# EAGLE design eCog101_I2C_TFT_.96 (EAGLE 6.6.0)
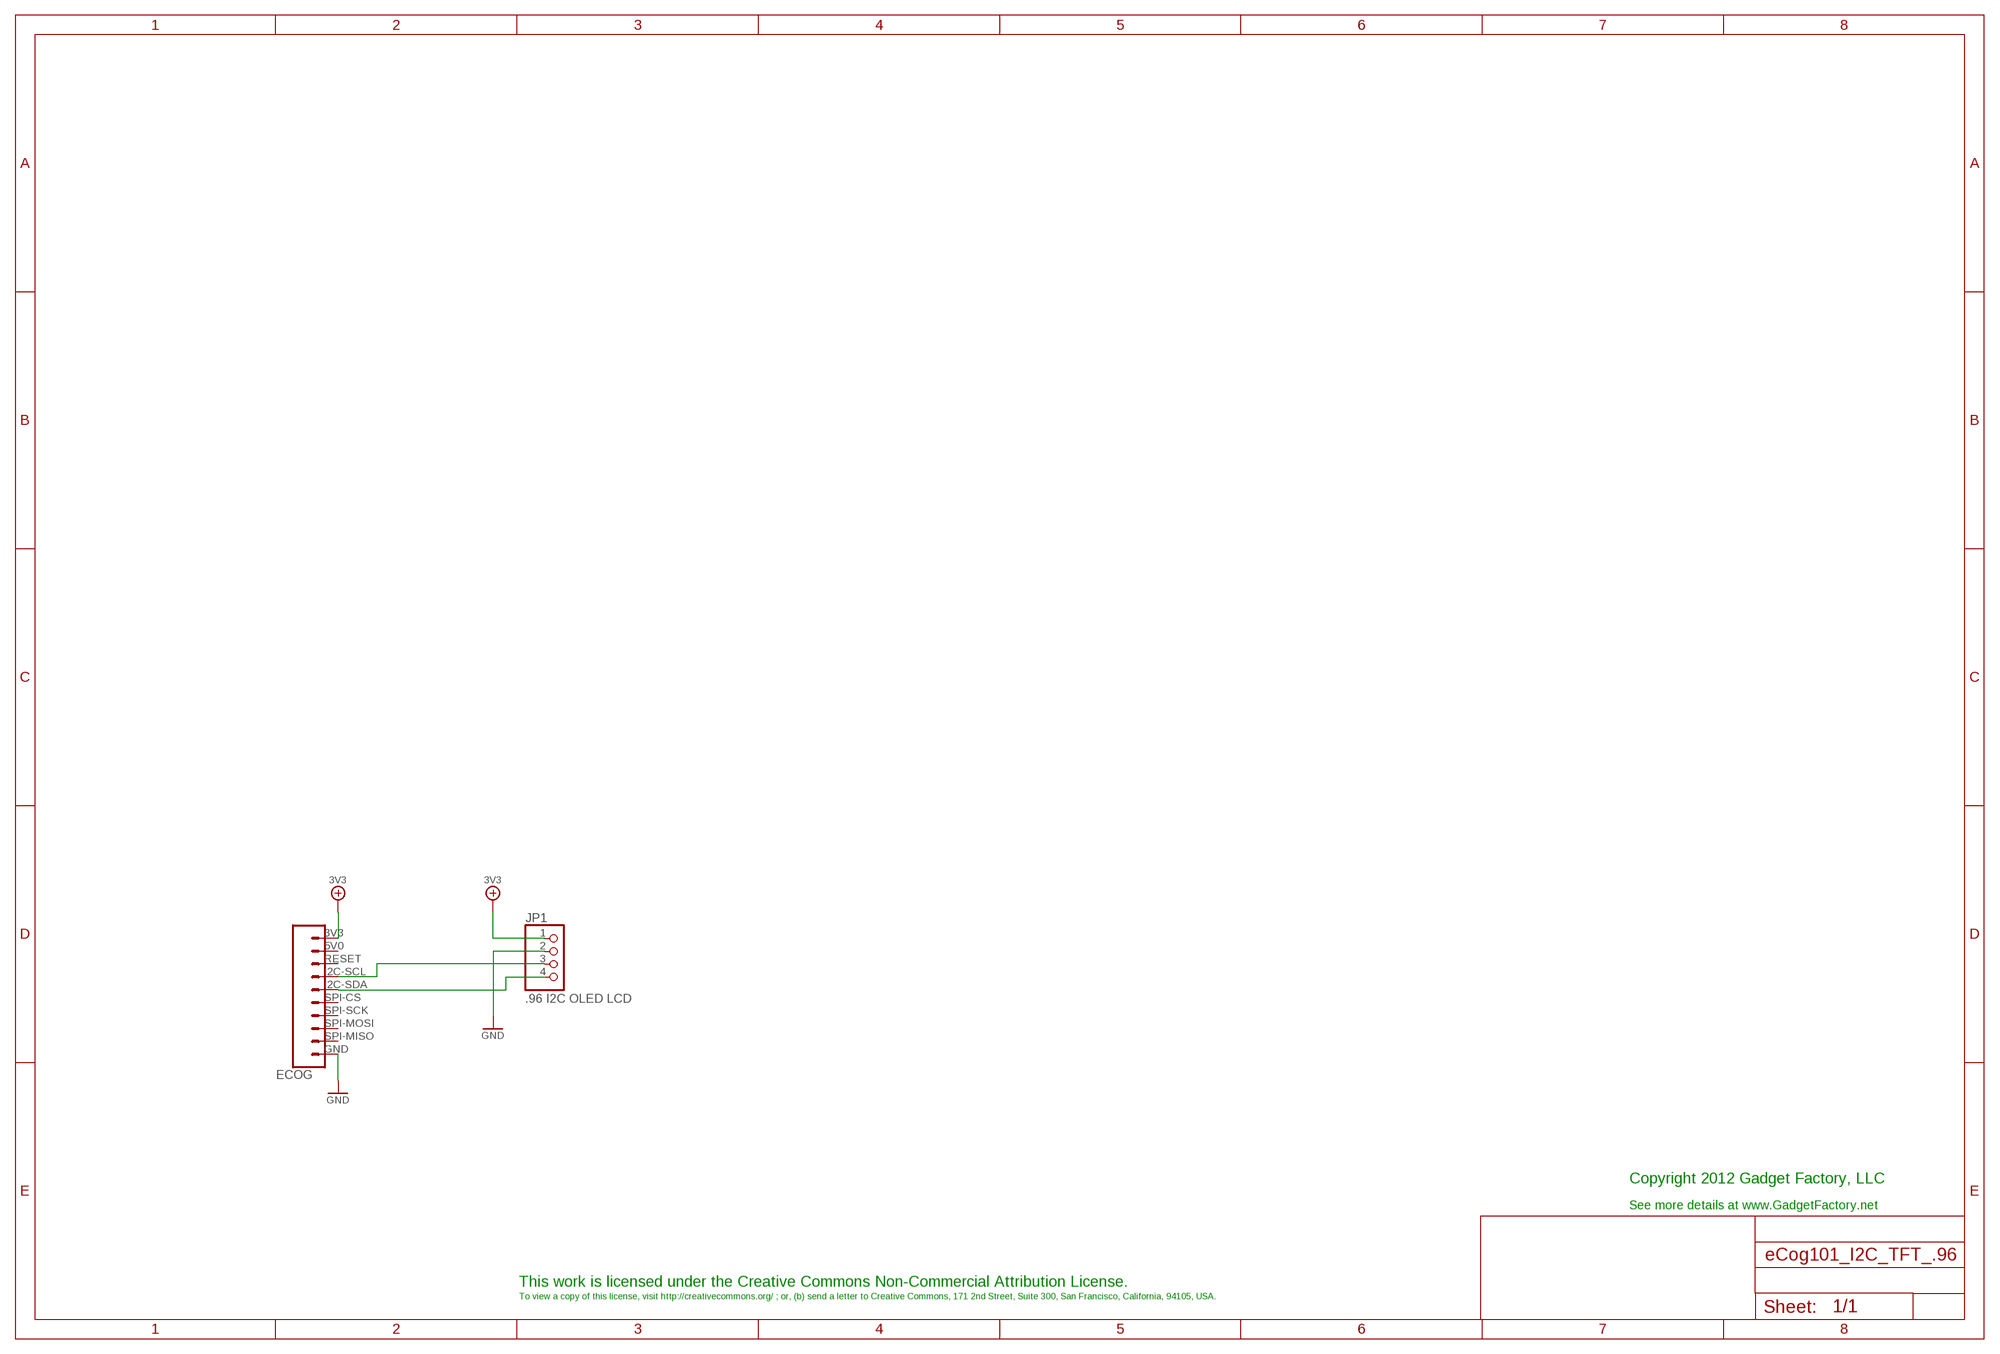
[diagram p0: schematic, sheet 1]

## Parts
ECOG  ECOG_BUSES_ROWECOG_BUSES_SMD  [ECOG_BUSES_SMD]
JP1  .96 I2C OLED LCD  PINHD-1X4  [1X04]

## Nets
3V3: ECOG.3V3 JP1.1
GND: ECOG.GND JP1.2
N$1: ECOG.I2C-SCL JP1.3
N$2: ECOG.I2C-SDA JP1.4
Unconnected: ECOG.5V0 ECOG.RESET ECOG.SPI-CS ECOG.SPI-MISO ECOG.SPI-MOSI ECOG.SPI-SCK

## Notes on the sheet
- Copyright 2012 Gadget Factory, LLC
- See more details at www.GadgetFactory.net
- This work is licensed under the Creative Commons Non-Commercial Attribution License.
- To view a copy of this license, visit http://creativecommons.org/ ; or, (b) send a letter to Creative Commons, 171 2nd Street, Suite 300, San Francisco, California, 94105, USA.

## Library data of the parts
ECOG = eCogs:ECOG_BUSES_ROW; DIGIKEY: S1013EC-10-ND
JP1 = pinhead:PINHD-1X4: PIN HEADER; DEALEXTREME: 419232

## Board
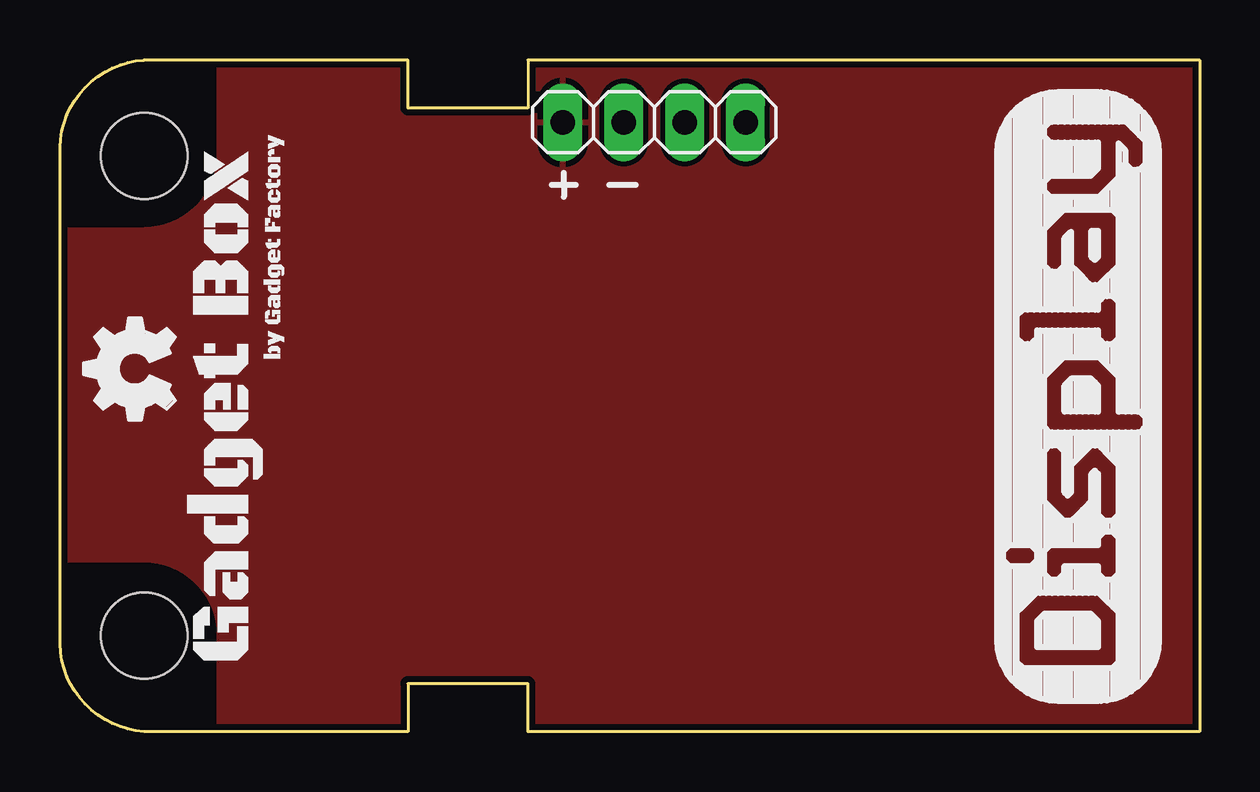
[diagram p1: board, top side]
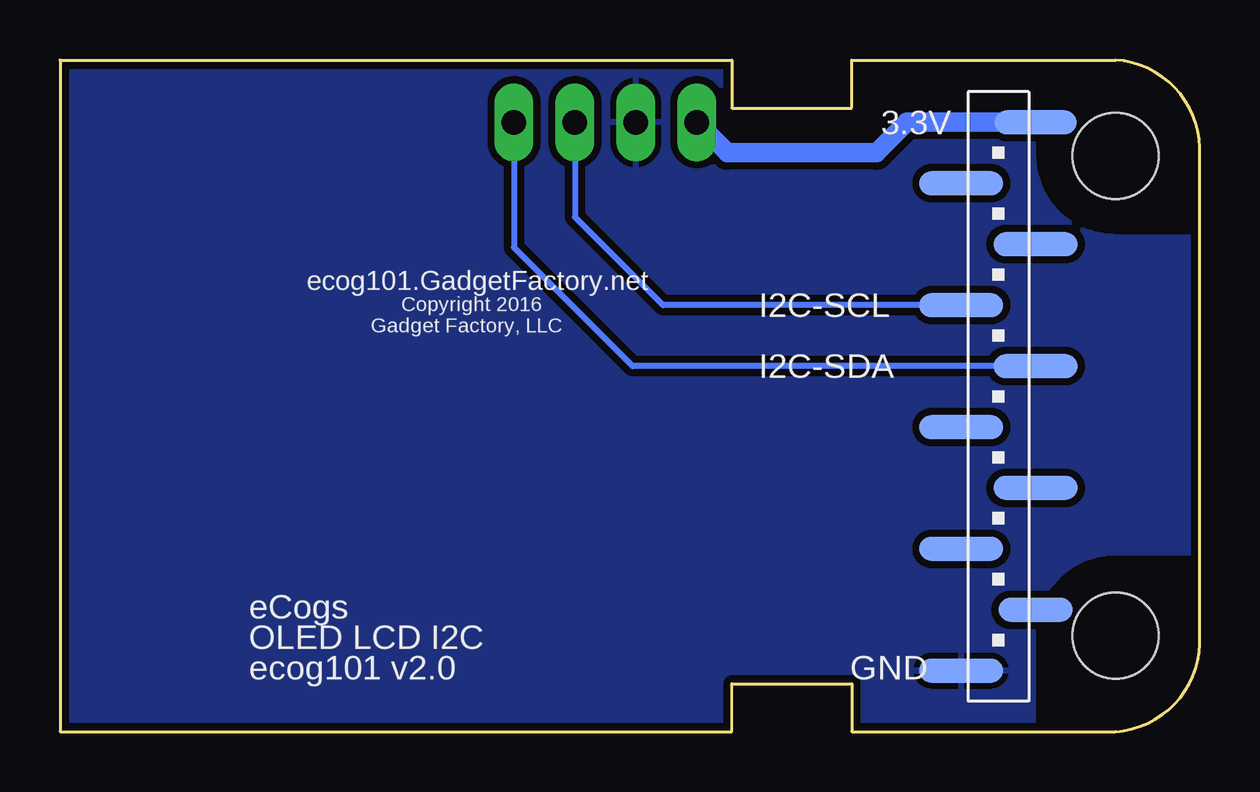
[diagram p2: board, bottom side, seen from below]

Size 47.51 x 28 mm. Coordinates in mm from the lower left corner, seen from the top.
Copper layers (1*16): Top 0.035mm / dielectric 1.5mm / Bottom 0.035mm
Design rules "SparkFun": minimum track width 8mil, minimum drill 20mil, track to track 8mil, track to pad 8mil, pad to pad 8mil, via to via 8mil, smd to smd 8mil, copper to edge 10mil, drill to drill 8mil, minimum pad ring 12mil, minimum via ring 10mil, stop-mask expansion 4mil, vias tented up to drill 25mil, thermal gap 10mil

### Footprints (pad centres in the part's own frame; a part is rotated, then mirrored left to right if it is on the bottom)
ECOG_BUSES_SMD = smd 3.4 x 1 bottom: 3V3 7.337,25.4 | smd 3.5 x 1 bottom: 5V0 10.436,22.86; GND 10.436,2.54; I2C-SCL 10.436,17.78; I2C-SDA 7.337,15.24; RESET 7.337,20.32; SPI-CS 10.436,12.7; SPI-MOSI 10.436,7.62; SPI-SCK 7.337,10.16 | smd 3.1 x 1 bottom: SPI-MISO 7.337,5.08 | hole 3.6: 4.004,24.003; 4.004,4.003
1X04 = drill 1.016 long: 1 -3.81,0; 2 -1.27,0; 3 1.27,0; 4 3.81,0

### Placement (x,y rotation side)
ECOG  ECOG_BUSES_ROWSURFACEMOUNT  [ECOG_BUSES_SMD]  -0.5,0 0 top
JP1  24.77,25.4 0 top
U$1  [GADGETBOX_SMALL]  6.95,13.65 90 top
U$2  [OSHW_FILLX150_NOTEXT]  4.8,13 90 top

### Tracks (layer width: path | path; a pad name or v marks a point on that pad's centre or on a via)
3V3
  Bottom 0.813: ECOG.3V3 12.2,25.4 13.47,24.13 19.69,24.13 JP1.1
  pour Top: -1.77,29.27 48.77,29.27 48.77,-1.27 -1.77,-1.27
GND
  pour Bottom (isolate 0.305): -3.04,30.54 50.04,30.54 50.04,-2.54 -3.04,-2.54
N$1
  Bottom 0.254: ECOG.I2C-SCL 22.36,17.78 26.04,21.46 JP1.3
N$2
  Bottom 0.254: ECOG.I2C-SDA 23.63,15.24 28.58,20.19 JP1.4

### Text on the board
bPlace: 3.3V | Copyright 2016 | ecog101.GadgetFactory.net | I2C-SCL | Gadget Factory, LLC | I2C-SDA | eCogs | OLED LCD I2C | GND | ecog101 v2.0